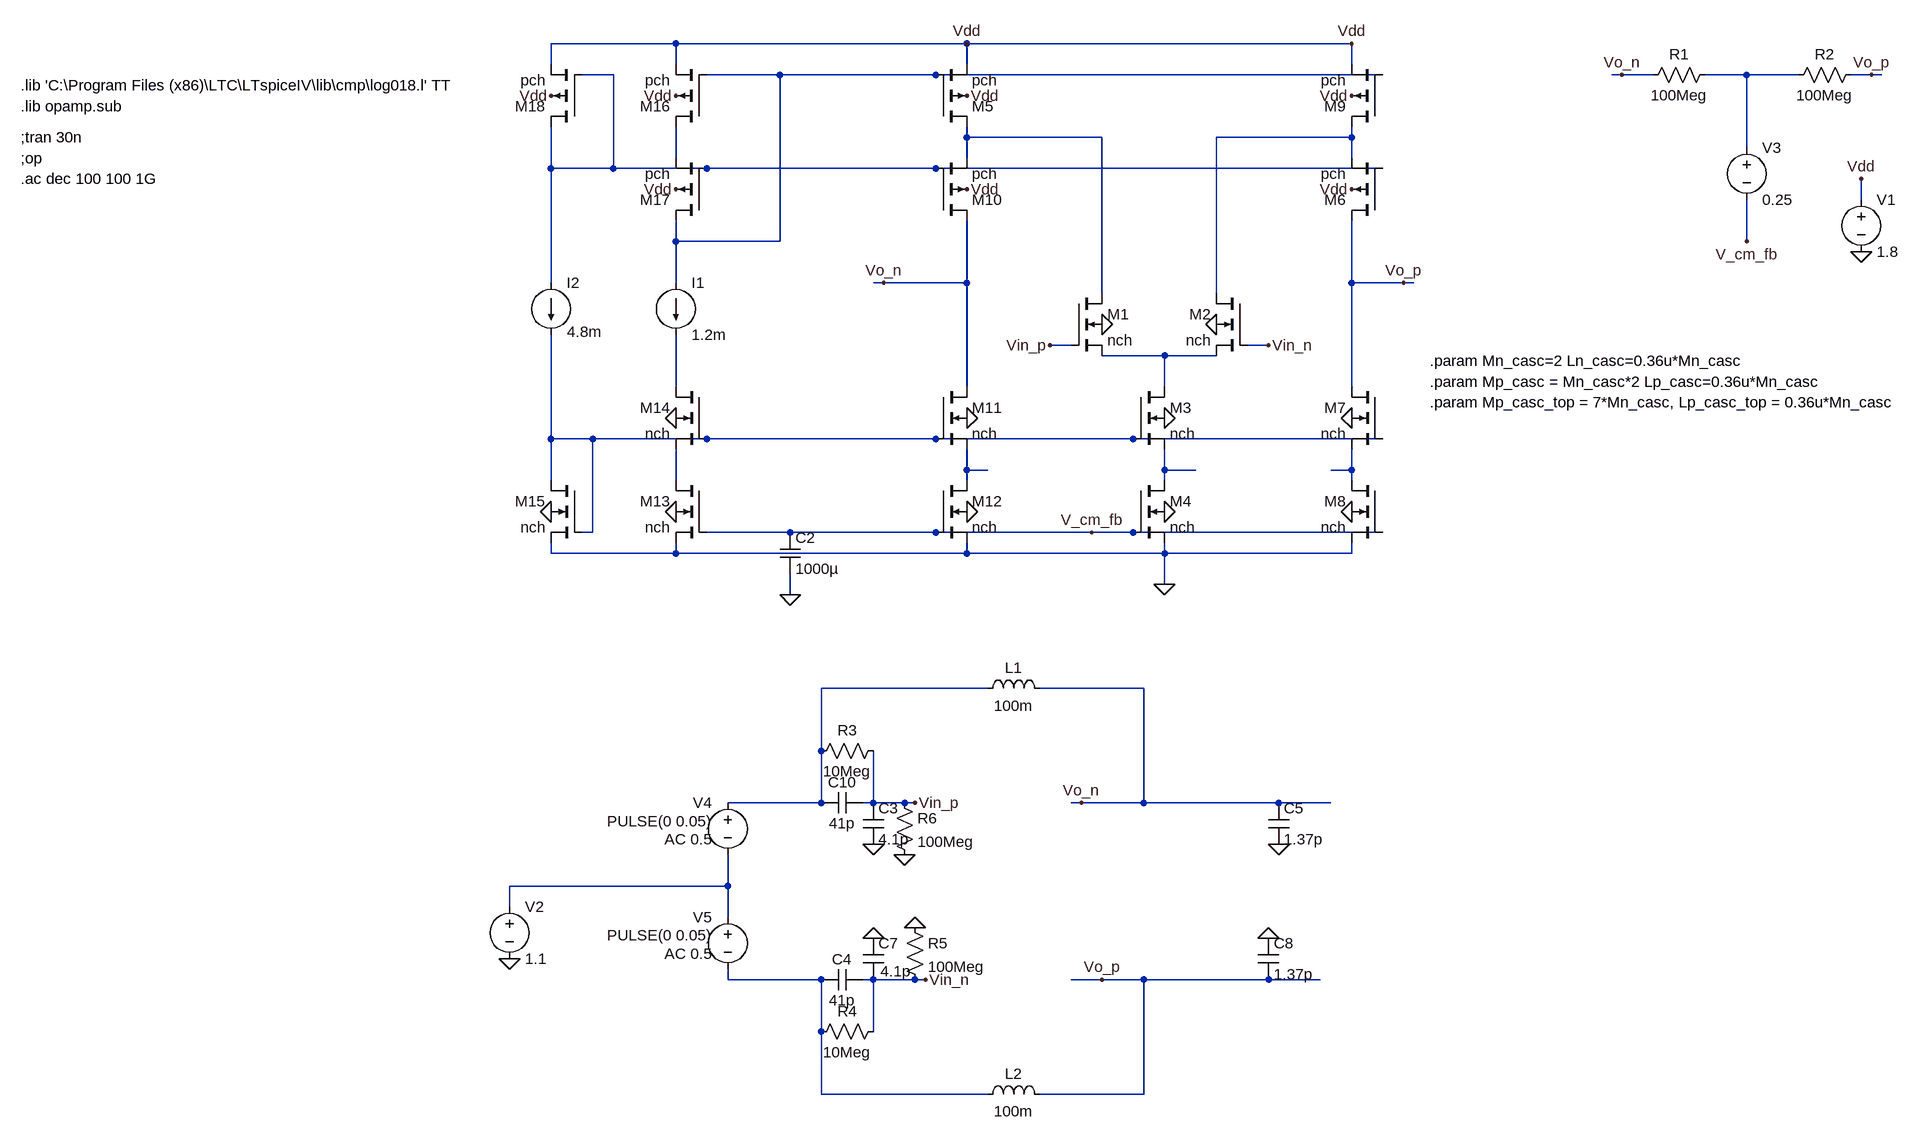
[diagram p0: schematic Discrete_Amplifier_LoopGain test.asc]
Discrete_Amplifier_LoopGain test.asc, the LTspice schematic file:
Version 4
SHEET 1 2764 800
WIRE 432 -864 240 -864
WIRE 880 -864 432 -864
WIRE 1376 -864 880 -864
WIRE 1472 -864 1376 -864
WIRE 240 -832 240 -864
WIRE 432 -832 432 -864
WIRE 880 -832 880 -864
WIRE 1472 -832 1472 -864
WIRE 336 -816 288 -816
WIRE 544 -816 480 -816
WIRE 592 -816 544 -816
WIRE 832 -816 592 -816
WIRE 1520 -816 832 -816
WIRE 1888 -816 1872 -816
WIRE 1936 -816 1888 -816
WIRE 2064 -816 2016 -816
WIRE 2080 -816 2064 -816
WIRE 2160 -816 2080 -816
WIRE 2272 -816 2240 -816
WIRE 2288 -816 2272 -816
WIRE 880 -720 880 -736
WIRE 992 -720 880 -720
WIRE 1088 -720 992 -720
WIRE 1360 -720 1264 -720
WIRE 1472 -720 1472 -736
WIRE 1472 -720 1360 -720
WIRE 2080 -704 2080 -816
WIRE 432 -688 432 -736
WIRE 880 -688 880 -720
WIRE 1472 -688 1472 -720
WIRE 240 -672 240 -736
WIRE 336 -672 336 -816
WIRE 336 -672 240 -672
WIRE 480 -672 336 -672
WIRE 528 -672 480 -672
WIRE 832 -672 528 -672
WIRE 1520 -672 832 -672
WIRE 2256 -624 2256 -656
WIRE 1088 -608 1088 -720
WIRE 432 -560 432 -592
WIRE 592 -560 592 -816
WIRE 592 -560 432 -560
WIRE 1472 -560 1472 -592
WIRE 2080 -560 2080 -624
WIRE 880 -544 880 -592
WIRE 240 -496 240 -672
WIRE 432 -496 432 -560
WIRE 752 -496 736 -496
WIRE 880 -496 880 -544
WIRE 880 -496 752 -496
WIRE 1472 -496 1472 -560
WIRE 1552 -496 1472 -496
WIRE 1568 -496 1552 -496
WIRE 1088 -480 1088 -608
WIRE 1264 -480 1264 -720
WIRE 1040 -400 1008 -400
WIRE 1344 -400 1312 -400
WIRE 1184 -384 1088 -384
WIRE 1264 -384 1184 -384
WIRE 432 -336 432 -416
WIRE 880 -336 880 -496
WIRE 1184 -336 1184 -384
WIRE 1472 -336 1472 -496
WIRE 240 -256 240 -416
WIRE 304 -256 240 -256
WIRE 480 -256 304 -256
WIRE 656 -256 480 -256
WIRE 832 -256 656 -256
WIRE 1136 -256 832 -256
WIRE 1520 -256 1136 -256
WIRE 880 -208 880 -240
WIRE 912 -208 880 -208
WIRE 1184 -208 1184 -240
WIRE 1232 -208 1184 -208
WIRE 1472 -208 1472 -240
WIRE 1472 -208 1440 -208
WIRE 240 -192 240 -256
WIRE 432 -192 432 -240
WIRE 880 -192 880 -208
WIRE 1184 -192 1184 -208
WIRE 1472 -192 1472 -208
WIRE 304 -112 304 -256
WIRE 304 -112 288 -112
WIRE 608 -112 480 -112
WIRE 672 -112 608 -112
WIRE 832 -112 672 -112
WIRE 1072 -112 832 -112
WIRE 1136 -112 1072 -112
WIRE 1520 -112 1136 -112
WIRE 240 -80 240 -96
WIRE 432 -80 432 -96
WIRE 432 -80 240 -80
WIRE 880 -80 880 -96
WIRE 880 -80 432 -80
WIRE 1184 -80 1184 -96
WIRE 1184 -80 880 -80
WIRE 1472 -80 1472 -96
WIRE 1472 -80 1184 -80
WIRE 1184 -32 1184 -80
WIRE 608 -16 608 -48
WIRE 912 128 656 128
WIRE 1152 128 992 128
WIRE 656 224 656 128
WIRE 656 304 656 224
WIRE 656 304 512 304
WIRE 736 304 736 224
WIRE 736 304 720 304
WIRE 784 304 736 304
WIRE 800 304 784 304
WIRE 1056 304 1040 304
WIRE 1152 304 1152 128
WIRE 1152 304 1056 304
WIRE 1360 304 1152 304
WIRE 1440 304 1360 304
WIRE 512 432 512 384
WIRE 512 432 176 432
WIRE 176 464 176 432
WIRE 512 480 512 432
WIRE 512 576 512 560
WIRE 656 576 512 576
WIRE 736 576 720 576
WIRE 800 576 736 576
WIRE 816 576 800 576
WIRE 1088 576 1040 576
WIRE 1152 576 1088 576
WIRE 1344 576 1152 576
WIRE 1424 576 1344 576
WIRE 656 656 656 576
WIRE 736 656 736 576
WIRE 656 752 656 656
WIRE 912 752 656 752
WIRE 1152 752 1152 576
WIRE 1152 752 992 752
FLAG 1088 -432 0
FLAG 1184 -288 0
FLAG 1184 -144 0
FLAG 1184 -32 0
FLAG 880 -288 0
FLAG 880 -144 0
FLAG 2256 -544 0
FLAG 2256 -656 Vdd
FLAG 880 -864 Vdd
FLAG 880 -640 Vdd
FLAG 880 -784 Vdd
FLAG 432 -144 0
FLAG 240 -144 0
FLAG 432 -288 0
FLAG 432 -784 Vdd
FLAG 432 -640 Vdd
FLAG 240 -784 Vdd
FLAG 1264 -432 0
FLAG 1472 -288 0
FLAG 1472 -144 0
FLAG 1472 -864 Vdd
FLAG 1472 -640 Vdd
FLAG 1472 -784 Vdd
FLAG 608 -16 0
FLAG 1072 -112 V_cm_fb
FLAG 2080 -560 V_cm_fb
FLAG 1008 -400 Vin_p
FLAG 1344 -400 Vin_n
FLAG 800 304 Vin_p
FLAG 816 576 Vin_n
FLAG 176 544 0
FLAG 752 -496 Vo_n
FLAG 1552 -496 Vo_p
FLAG 2272 -816 Vo_p
FLAG 1888 -816 Vo_n
FLAG 1088 576 Vo_p
FLAG 1056 304 Vo_n
FLAG 1360 368 0
FLAG 1344 512 0
FLAG 736 368 0
FLAG 736 512 0
FLAG 800 496 0
FLAG 784 384 0
DATAFLAG 912 -208 "round($*10k)/10k"
DATAFLAG 1184 -384 "round($*10k)/10k"
DATAFLAG 1232 -208 "round($*10k)/10k"
DATAFLAG 992 -720 "round($*1k)/1k"
DATAFLAG 880 -544 "round($*1k)/1k"
DATAFLAG 1440 -208 "round($*10k)/10k"
DATAFLAG 1360 -720 "round($*1k)/1k"
DATAFLAG 1376 -864 "round($*1k)/1k"
DATAFLAG 1472 -560 "round($*1k)/1k"
DATAFLAG 1088 -608 "Id(M1)"
DATAFLAG 2064 -816 ""
DATAFLAG 544 -816 ""
DATAFLAG 528 -672 ""
DATAFLAG 656 -256 ""
DATAFLAG 672 -112 ""
DATAFLAG 800 -400 "Id(M11)"
DATAFLAG 960 -832 "-Id(M5)"
SYMBOL nmos4 1040 -480 R0
SYMATTR InstName M1
SYMATTR Value nch
SYMATTR Value2 l=1.5u w=20u m=18
SYMBOL nmos4 1136 -336 R0
SYMATTR InstName M3
SYMATTR Value nch
SYMATTR Value2 l={Ln_casc} w=86u m={Mn_casc}
SYMBOL nmos4 1136 -192 R0
SYMATTR InstName M4
SYMATTR Value nch
SYMATTR Value2 l={Ln_casc} w=86u m={Mn_casc}
SYMBOL pmos4 832 -592 M180
SYMATTR InstName M10
SYMATTR Value pch
SYMATTR Value2 l={Lp_casc} w=51u m={Mp_casc}
SYMBOL nmos4 832 -336 R0
SYMATTR InstName M11
SYMATTR Value nch
SYMATTR Value2 l={Ln_casc} w=43u m={Mn_casc}
SYMBOL nmos4 832 -192 R0
SYMATTR InstName M12
SYMATTR Value nch
SYMATTR Value2 l={Ln_casc} w=43u m={Mn_casc}
SYMBOL voltage 2256 -640 R0
WINDOW 123 0 0 Left 2
WINDOW 39 0 0 Left 2
SYMATTR InstName V1
SYMATTR Value 1.8
SYMBOL pmos4 832 -736 M180
SYMATTR InstName M5
SYMATTR Value pch
SYMATTR Value2 l={Lp_casc_top} w=28u m={Mp_casc_top}
SYMBOL res 2032 -832 R90
WINDOW 0 0 56 VBottom 2
WINDOW 3 32 56 VTop 2
SYMATTR InstName R1
SYMATTR Value 100Meg
SYMBOL res 2256 -832 R90
WINDOW 0 0 56 VBottom 2
WINDOW 3 32 56 VTop 2
SYMATTR InstName R2
SYMATTR Value 100Meg
SYMBOL nmos4 480 -192 M0
SYMATTR InstName M13
SYMATTR Value nch
SYMATTR Value2 l=0.36u w=86u
SYMBOL current 432 -496 R0
WINDOW 123 0 0 Left 2
WINDOW 39 0 0 Left 2
SYMATTR InstName I1
SYMATTR Value 1.2m
SYMBOL nmos4 480 -336 M0
SYMATTR InstName M14
SYMATTR Value nch
SYMATTR Value2 l=0.36u w=86u
SYMBOL current 240 -496 R0
WINDOW 123 0 0 Left 2
WINDOW 39 0 0 Left 2
WINDOW 3 25 75 Left 2
SYMATTR Value 4.8m
SYMATTR InstName I2
SYMBOL nmos4 288 -192 M0
SYMATTR InstName M15
SYMATTR Value nch
SYMATTR Value2 l=0.36u w=86u
SYMBOL pmos4 480 -736 R180
SYMATTR InstName M16
SYMATTR Value pch
SYMATTR Value2 l=0.36u w=28u m=7
SYMBOL pmos4 480 -592 R180
SYMATTR InstName M17
SYMATTR Value pch
SYMATTR Value2 l=0.36u w=51u m=2
SYMBOL pmos4 288 -736 R180
SYMATTR InstName M18
SYMATTR Value pch
SYMATTR Value2 l=0.36u w=51u m=2
SYMBOL nmos4 1312 -480 M0
SYMATTR InstName M2
SYMATTR Value nch
SYMATTR Value2 l=1.5u w=20u m=18
SYMBOL pmos4 1520 -592 R180
SYMATTR InstName M6
SYMATTR Value pch
SYMATTR Value2 l={Lp_casc} w=51u m={Mp_casc}
SYMBOL nmos4 1520 -336 M0
SYMATTR InstName M7
SYMATTR Value nch
SYMATTR Value2 l={Ln_casc} w=43u m={Mn_casc}
SYMBOL nmos4 1520 -192 M0
SYMATTR InstName M8
SYMATTR Value nch
SYMATTR Value2 l={Ln_casc} w=43u m={Mn_casc}
SYMBOL pmos4 1520 -736 R180
SYMATTR InstName M9
SYMATTR Value pch
SYMATTR Value2 l={Lp_casc_top} w=28u m={Mp_casc_top}
SYMBOL cap 592 -112 R0
SYMATTR InstName C2
SYMATTR Value 1000µ
SYMBOL Overige\ componenten\\voltage 2080 -720 R0
WINDOW 123 0 0 Left 2
WINDOW 39 0 0 Left 2
SYMATTR InstName V3
SYMATTR Value 0.25
SYMBOL Overige\ componenten\\voltage 176 448 R0
WINDOW 123 0 0 Left 2
WINDOW 39 0 0 Left 2
SYMATTR InstName V2
SYMATTR Value 1.1
SYMBOL Overige\ componenten\\voltage 512 288 M0
WINDOW 3 24 44 Left 2
WINDOW 123 24 72 Left 2
WINDOW 39 0 0 Left 2
SYMATTR Value PULSE(0 0.05)
SYMATTR Value2 AC 0.5
SYMATTR InstName V4
SYMBOL Overige\ componenten\\voltage 512 464 M0
WINDOW 3 24 44 Left 2
WINDOW 123 24 72 Left 2
WINDOW 39 0 0 Left 2
SYMATTR Value PULSE(0 0.05)
SYMATTR Value2 AC 0.5
SYMATTR InstName V5
SYMBOL ind 896 144 R270
WINDOW 0 32 56 VTop 2
WINDOW 3 5 56 VBottom 2
SYMATTR InstName L1
SYMATTR Value 100m
SYMBOL ind 896 768 R270
WINDOW 0 32 56 VTop 2
WINDOW 3 5 56 VBottom 2
SYMATTR InstName L2
SYMATTR Value 100m
SYMBOL cap 1344 304 R0
SYMATTR InstName C5
SYMATTR Value 1.37p
SYMBOL cap 1328 512 R0
SYMATTR InstName C8
SYMATTR Value 1.37p
SYMBOL cap 720 288 R90
WINDOW 0 0 32 VBottom 2
WINDOW 3 32 32 VTop 2
SYMATTR InstName C10
SYMATTR Value 41p
SYMBOL cap 720 304 R0
SYMATTR InstName C3
SYMATTR Value 4.1p
SYMBOL cap 720 560 R90
WINDOW 0 0 32 VBottom 2
WINDOW 3 32 32 VTop 2
SYMATTR InstName C4
SYMATTR Value 41p
SYMBOL cap 720 512 R0
WINDOW 3 27 51 Left 2
SYMATTR InstName C7
SYMATTR Value 4.1p
SYMBOL res 640 240 R270
WINDOW 0 32 56 VTop 2
WINDOW 3 0 56 VBottom 2
SYMATTR InstName R3
SYMATTR Value 10Meg
SYMBOL res 752 640 R90
WINDOW 0 0 56 VBottom 2
WINDOW 3 32 56 VTop 2
SYMATTR InstName R4
SYMATTR Value 10Meg
SYMBOL res 784 480 R0
SYMATTR InstName R5
SYMATTR Value 100Meg
SYMBOL res 768 288 R0
SYMATTR InstName R6
SYMATTR Value 100Meg
TEXT -576 -800 Left 2 !.lib 'C:\\Program Files (x86)\\LTC\\LTspiceIV\\lib\\cmp\\log018.l' TT
TEXT -576 -720 Left 2 !;tran 30n
TEXT -576 -768 Left 2 !.lib opamp.sub
TEXT -576 -688 Left 2 !;op
TEXT -576 -656 Left 2 !.ac dec 100 100 1G
TEXT 1592 -376 Left 2 !.param Mn_casc=2 Ln_casc=0.36u*Mn_casc
TEXT 1592 -344 Left 2 !.param Mp_casc = Mn_casc*2 Lp_casc=0.36u*Mn_casc
TEXT 1592 -312 Left 2 !.param Mp_casc_top = 7*Mn_casc, Lp_casc_top = 0.36u*Mn_casc

The netlist it stands for:
* Discrete_Amplifier_LoopGain test.asc
M1 N004 Vin_p N007 0 nch l=1.5u w=20u m=18
M3 N007 N009 N011 0 nch l={Ln_casc} w=86u m={Mn_casc}
M4 N011 V_cm_fb 0 0 nch l={Ln_casc} w=86u m={Mn_casc}
M10 Vo_n N001 N004 Vdd pch l={Lp_casc} w=51u m={Mp_casc}
M11 Vo_n N009 N010 0 nch l={Ln_casc} w=43u m={Mn_casc}
M12 N010 V_cm_fb 0 0 nch l={Ln_casc} w=43u m={Mn_casc}
V1 Vdd 0 1.8
M5 N004 N002 Vdd Vdd pch l={Lp_casc_top} w=28u m={Mp_casc_top}
R1 N003 Vo_n 100Meg
R2 Vo_p N003 100Meg
M13 N013 V_cm_fb 0 0 nch l=0.36u w=86u
I1 N002 N008 1.2m
M14 N008 N009 N013 0 nch l=0.36u w=86u
I2 N001 N009 4.8m
M15 N009 N009 0 0 nch l=0.36u w=86u
M16 N006 N002 Vdd Vdd pch l=0.36u w=28u m=7
M17 N002 N001 N006 Vdd pch l=0.36u w=51u m=2
M18 N001 N001 Vdd Vdd pch l=0.36u w=51u m=2
M2 N005 Vin_n N007 0 nch l=1.5u w=20u m=18
M6 Vo_p N001 N005 Vdd pch l={Lp_casc} w=51u m={Mp_casc}
M7 Vo_p N009 N012 0 nch l={Ln_casc} w=43u m={Mn_casc}
M8 N012 V_cm_fb 0 0 nch l={Ln_casc} w=43u m={Mn_casc}
M9 N005 N002 Vdd Vdd pch l={Lp_casc_top} w=28u m={Mp_casc_top}
C2 V_cm_fb 0 1000µ
V3 N003 V_cm_fb 0.25
V2 N015 0 1.1
V4 N014 N015 PULSE(0 0.05) AC 0.5
V5 N015 N016 PULSE(0 0.05) AC 0.5
L1 N014 Vo_n 100m
L2 N016 Vo_p 100m
C5 Vo_n 0 1.37p
C8 0 Vo_p 1.37p
C10 Vin_p N014 41p
C3 Vin_p 0 4.1p
C4 Vin_n N016 41p
C7 0 Vin_n 4.1p
R3 N014 Vin_p 10Meg
R4 Vin_n N016 10Meg
R5 0 Vin_n 100Meg
R6 Vin_p 0 100Meg
.model NMOS NMOS
.model PMOS PMOS
.lib standard.mos
.lib 'C:\Program Files (x86)\LTC\LTspiceIV\lib\cmp\log018.l' TT
;tran 30n
.lib opamp.sub
;op
.ac dec 100 100 1G
.param Mn_casc=2 Ln_casc=0.36u*Mn_casc
.param Mp_casc = Mn_casc*2 Lp_casc=0.36u*Mn_casc
.param Mp_casc_top = 7*Mn_casc, Lp_casc_top = 0.36u*Mn_casc
.backanno
.end